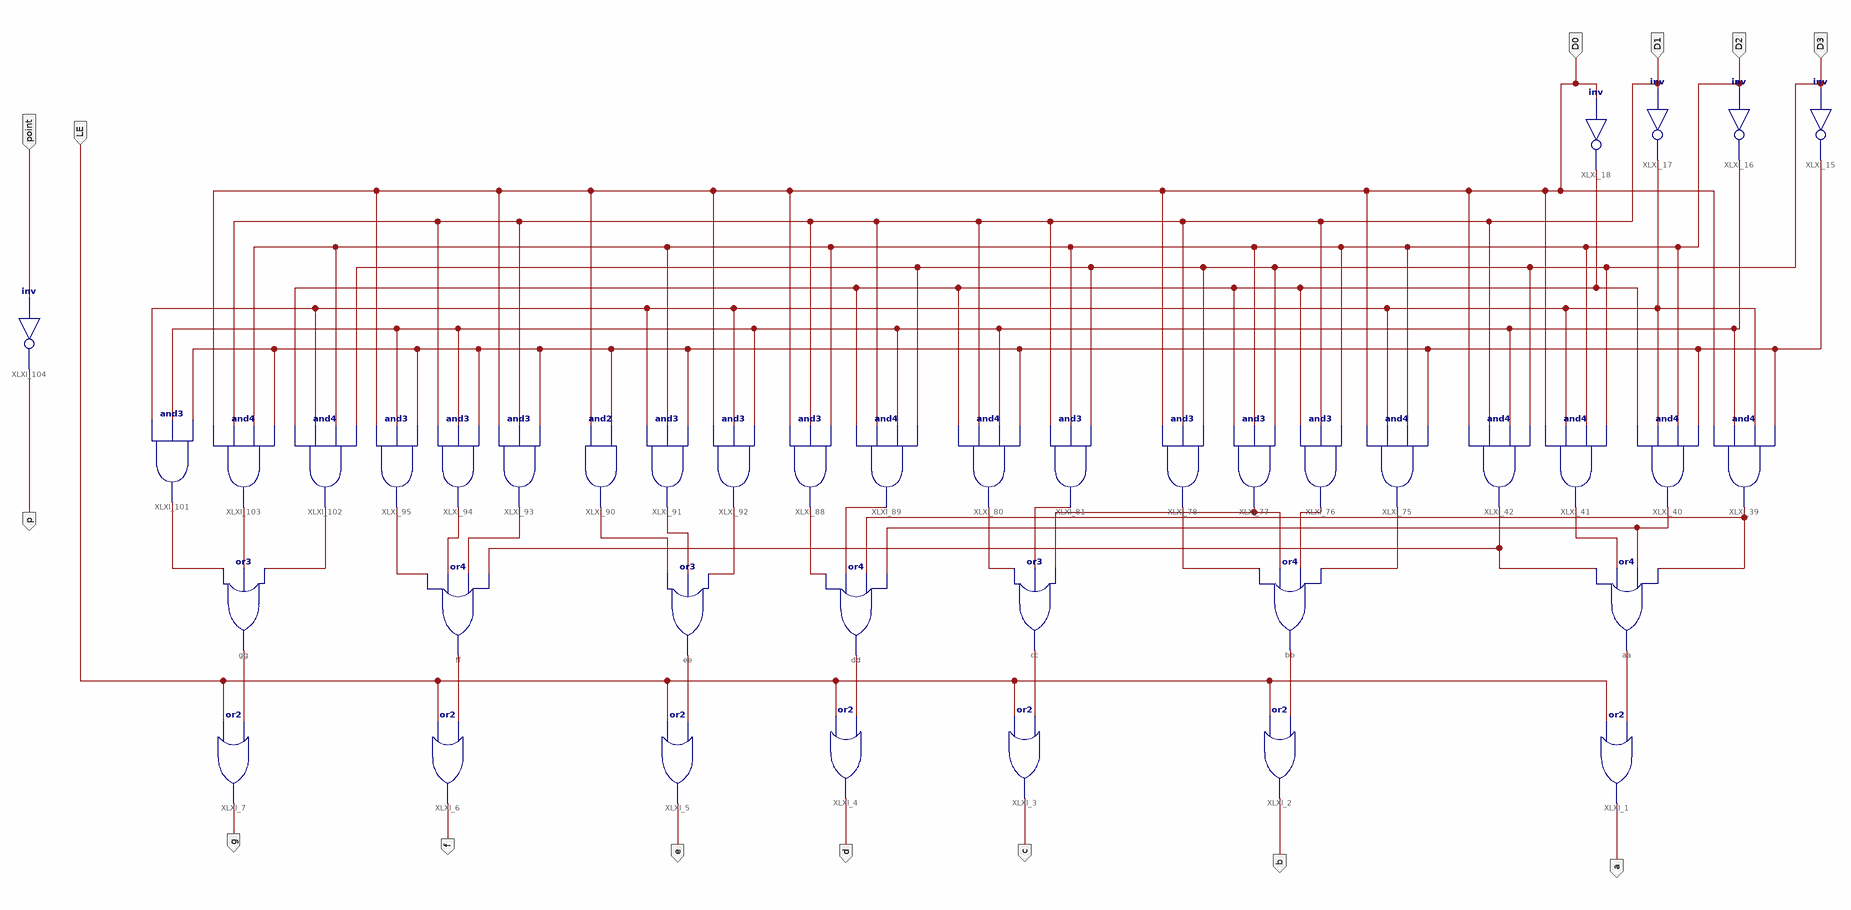
[diagram p0: schematic sheet 1]
// Xilinx ISE schematic MyMC14495.sch (kintex7) as structural Verilog: 40 symbols, 14 ports
module MyMC14495 (
  input  D0,
  input  D1,
  input  D2,
  input  D3,
  input  LE,
  input  point,
  output p,
  output g,
  output f,
  output e,
  output d,
  output c,
  output b,
  output a
);

  wire ND0, ND1, ND2, ND3, XLXN_27, XLXN_28, XLXN_29, XLXN_30, XLXN_31, XLXN_32, XLXN_33, XLXN_34, XLXN_39,
       XLXN_40, XLXN_41, XLXN_42, XLXN_46, XLXN_48, XLXN_49, XLXN_50, XLXN_51, XLXN_52, XLXN_53, XLXN_54,
       XLXN_55, XLXN_58, XLXN_59, XLXN_60, XLXN_61, XLXN_63, XLXN_64, XLXN_65;

  not XLXI_18 (ND0, D0);
  not XLXI_17 (ND1, D1);
  not XLXI_16 (ND2, D2);
  not XLXI_15 (ND3, D3);
  or XLXI_1 (a, LE, XLXN_58);
  or XLXI_2 (b, LE, XLXN_59);
  or XLXI_3 (c, LE, XLXN_60);
  or XLXI_4 (d, LE, XLXN_61);
  or XLXI_5 (e, LE, XLXN_63);
  or XLXI_6 (f, LE, XLXN_64);
  or XLXI_7 (g, LE, XLXN_65);
  and XLXI_40 (XLXN_29, ND0, ND1, D2, ND3);
  and XLXI_41 (XLXN_28, D0, ND1, D2, D3);
  and XLXI_42 (XLXN_27, D0, D1, ND2, D3);
  and XLXI_39 (XLXN_30, D0, ND2, ND1, ND3);
  or aa (XLXN_58, XLXN_27, XLXN_28, XLXN_29, XLXN_30);
  and XLXI_75 (XLXN_34, D0, ND1, D2, ND3);
  and XLXI_76 (XLXN_33, ND0, D1, D2);
  and XLXI_77 (XLXN_32, ND0, D2, D3);
  and XLXI_78 (XLXN_31, D0, D1, D3);
  or bb (XLXN_59, XLXN_31, XLXN_32, XLXN_33, XLXN_34);
  and XLXI_80 (XLXN_39, ND0, D1, ND2, ND3);
  and XLXI_81 (XLXN_40, D1, D2, D3);
  or cc (XLXN_60, XLXN_39, XLXN_40, XLXN_32);
  or ee (XLXN_63, XLXN_46, XLXN_48, XLXN_49);
  or gg (XLXN_65, XLXN_53, XLXN_54, XLXN_55);
  or dd (XLXN_61, XLXN_41, XLXN_42, XLXN_30, XLXN_29);
  or ff (XLXN_64, XLXN_50, XLXN_51, XLXN_52, XLXN_27);
  and XLXI_88 (XLXN_41, D0, D1, D2);
  and XLXI_89 (XLXN_42, ND0, D1, ND2, D3);
  and XLXI_90 (XLXN_46, D0, ND3);
  and XLXI_91 (XLXN_48, ND1, D2, ND3);
  and XLXI_92 (XLXN_49, D0, ND1, ND2);
  and XLXI_93 (XLXN_52, D0, D1, ND3);
  and XLXI_94 (XLXN_51, D1, ND2, ND3);
  and XLXI_95 (XLXN_50, D0, ND2, ND3);
  and XLXI_101 (XLXN_53, ND1, ND2, ND3);
  and XLXI_102 (XLXN_55, ND0, ND1, D2, D3);
  and XLXI_103 (XLXN_54, D0, D1, D2, ND3);
  not XLXI_104 (p, point);
endmodule
